# Altium schematic sheet 1602液晶屏.SchDoc
size A4
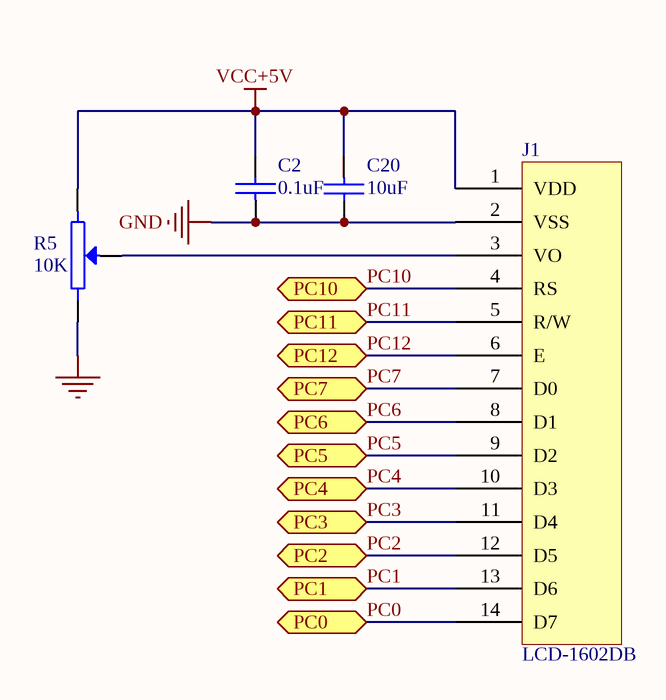
[diagram p0: 1602液晶屏.SchDoc]

## Parts
C2  0.1uF  [0603]
C20  10uF  [0805]
J1  LCD-1602DB  [LCD-1602B]
R5  10K  [RM065-V1]

## Ports
PC0, PC1, PC2, PC3, PC4, PC5, PC6, PC7, PC10, PC11, PC12

## Nets
GND: C2.1 C20.2 J1.2(VSS) R5.3
VCC+5V: C2.2 C20.1 J1.1(VDD) R5.1
PC0: J1.14(D7) ; port PC0
PC1: J1.13(D6) ; port PC1
PC2: J1.12(D5) ; port PC2
PC3: J1.11(D4) ; port PC3
PC4: J1.10(D3) ; port PC4
PC5: J1.9(D2) ; port PC5
PC6: J1.8(D1) ; port PC6
PC7: J1.7(D0) ; port PC7
PC10: J1.4(RS) ; port PC10
PC11: J1.5(R/W) ; port PC11
PC12: J1.6(E) ; port PC12
NetJ1_3: J1.3(VO) R5.2

## Library data of the parts
C2 = CAP-0603: 0603陶瓷贴片电容
C20 = CAP-0805: 0805陶瓷贴片电容
R5 = POT2: 三端可调电位器10K